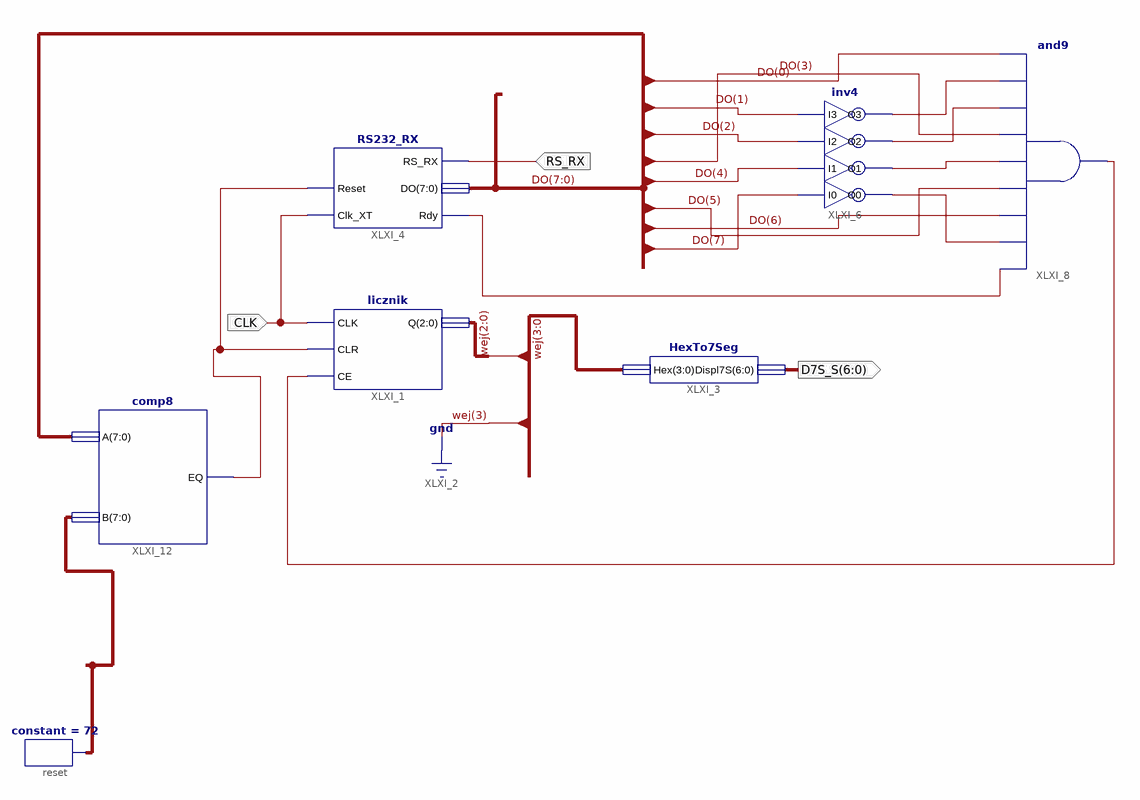
[diagram p0: schematic sheet 1]
// Xilinx ISE schematic dwa_dwa.sch (xc9500xl) as structural Verilog: 7 symbols, 3 ports
module dwa_dwa (
  input  CLK,
  input  RS_RX,
  output [6:0] D7S_S
);

  wire CE, CLR, XLXN_17, XLXN_18, XLXN_20, XLXN_21, XLXN_22;
  wire [2:0] wej;
  wire [7:0] DO, XLXN_31;

  licznik XLXI_1 (.CLK(CLK), .CLR(CLR), .CE(CE), .Q(wej));
  HexTo7Seg XLXI_3 (.Hex({1'b0, wej}), .Displ7S(D7S_S));
  RS232_RX XLXI_4 (.Reset(CLR), .Clk_XT(CLK), .Rdy(XLXN_22), .DO(DO), .RS_RX(RS_RX));
  inv4 XLXI_6 (.I0(DO[7]), .I1(DO[4]), .I2(DO[2]), .I3(DO[1]), .O0(XLXN_21), .O1(XLXN_20), .O2(XLXN_18), .O3(XLXN_17));
  and XLXI_8 (CE, XLXN_22, XLXN_21, DO[6], DO[5], XLXN_20, DO[3], XLXN_18, XLXN_17, DO[0]);
  constant #(.CValue("72")) reset (.O(XLXN_31));
  comp8 XLXI_12 (.A(DO), .B(XLXN_31), .EQ(CLR));
endmodule
